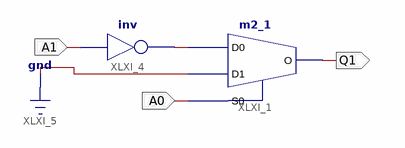
[diagram p0: schematic sheet 1]
// Xilinx ISE schematic q1.sch (spartan3) as structural Verilog: 2 symbols, 3 ports
module q1 (
  input  A0,
  input  A1,
  output Q1
);

  wire XLXN_4;

  m2_1 XLXI_1 (.D0(XLXN_4), .D1(1'b0), .S0(A0), .O(Q1));
  not XLXI_4 (XLXN_4, A1);
endmodule
